# EasyEDA Pro project ProPrj_ESP系列自动烧录平台_2024-12-23.epro, schematic ESP系列自动烧录平台 copy
Board Name: ESP系列自动烧录平台 copy; Create Date: 2024-03-04; Page Name: ESP全系列烧录平台 copy; Project Name: ESP系列自动烧录平台; Schematic Name: ESP系列自动烧录平台 copy; Update Date: 2024-04-26; Drawed: clistery
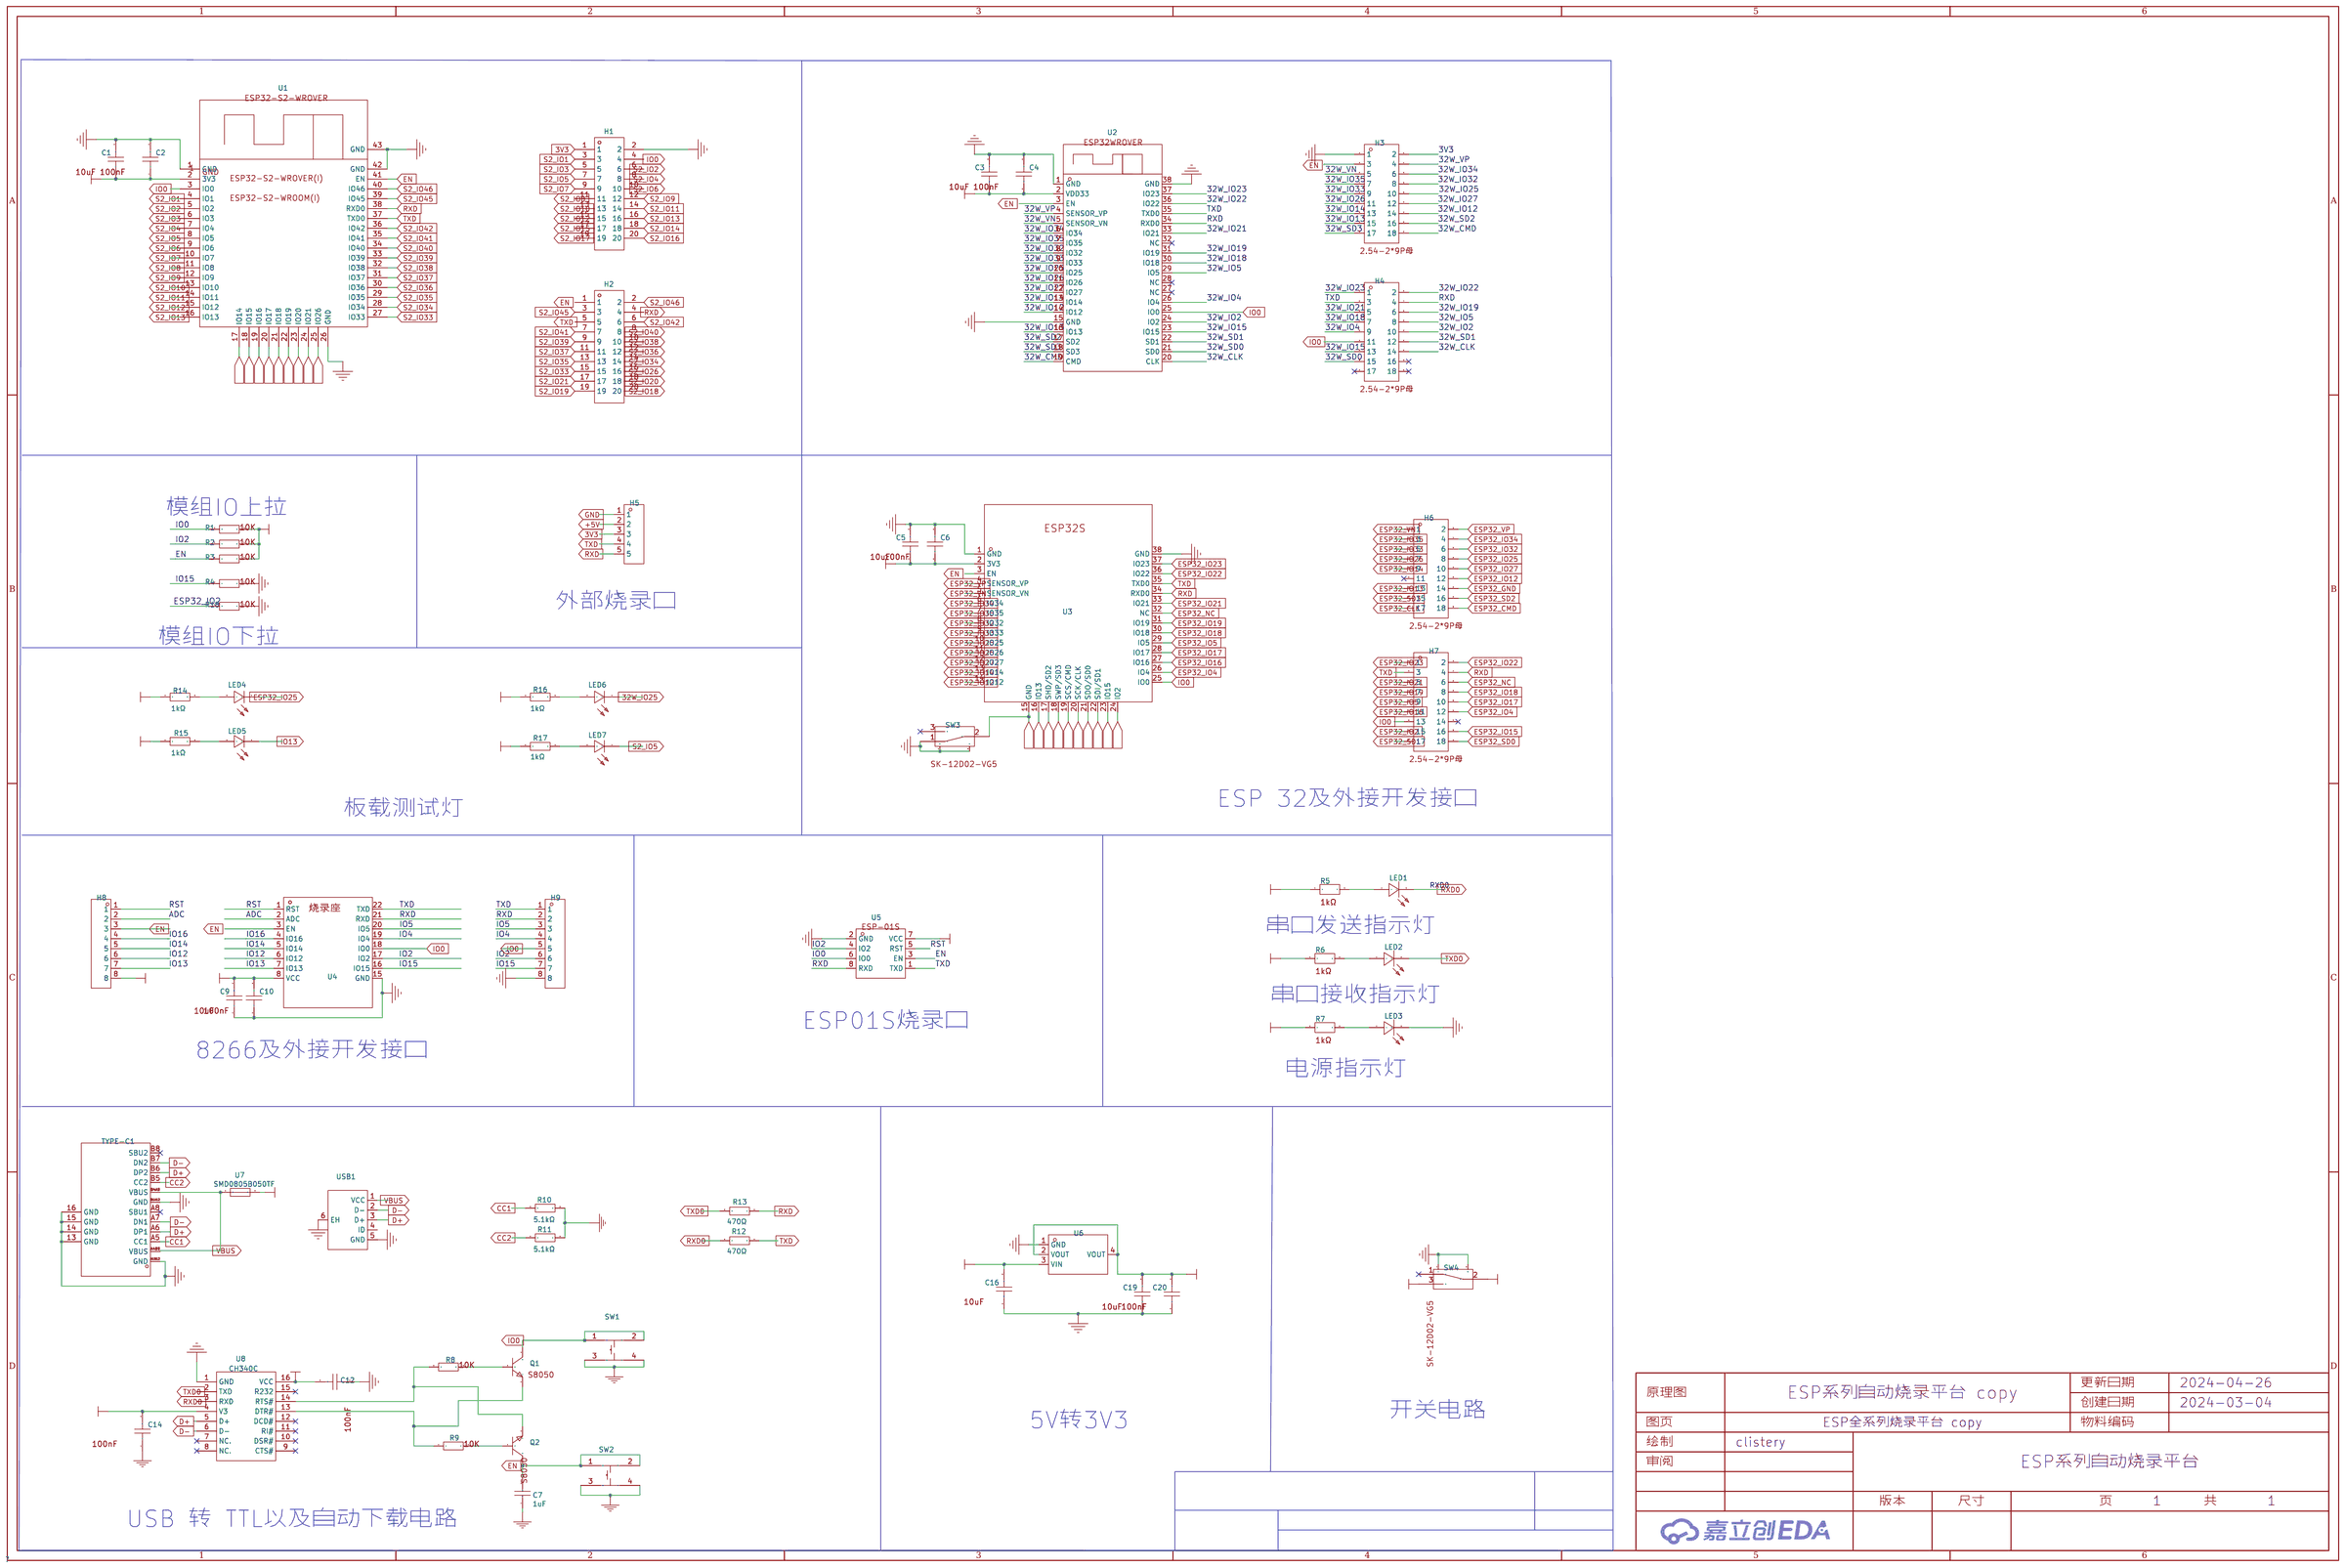
[diagram p0: schematic sheet]

## Parts
C1  10uF  [10uF]
C2  100nF  [100nF]
C3  10uF  [10uF]
C4  100nF  [100nF]
C5  10uF  [10uF]
C6  100nF  [100nF]
C7  1uF  [C0603]
C9  10uF  [10uF]
C10  100nF  [100nF]
C12  100nF  [100nF]
C14  100nF  [100nF]
C16  10uF  [10uF]
C19  10uF  [10uF]
C20  100nF  [100nF]
H1  220S-2*10P H=8.5MM Ytype Gold-plated  [HDR-TH_20P-P2.54-V-F-R2-C10-S2.54]
H2  220S-2*10P H=8.5MM Ytype Gold-plated  [HDR-TH_20P-P2.54-V-F-R2-C10-S2.54]
H3  2.54-2*9P母  [2.54-2*9P母]
H4  2.54-2*9P母  [2.54-2*9P母]
H5  PH-00759  [PH-00759]
H6  2.54-2*9P母  [2.54-2*9P母]
H7  2.54-2*9P母  [2.54-2*9P母]
H8  KH-2.54PH180-1X8P-L11.5  [KH-2.54PH180-1X8P-L11.5]
H9  KH-2.54PH180-1X8P-L11.5  [KH-2.54PH180-1X8P-L11.5]
LED1  NCD0603R3  [NCD0603R3]
LED2  NCD0603R3  [NCD0603R3]
LED3  NCD0603R3  [NCD0603R3]
LED4  FC-DA1608HRK-620D  [LED0603-RD_RED]
LED5  FC-DA1608HRK-620D  [LED0603-RD_RED]
LED6  FC-DA1608HRK-620D  [LED0603-RD_RED]
LED7  FC-DA1608HRK-620D  [LED0603-RD_RED]
Q1  S8050  [S8050]
Q2  S8050  [S8050]
R1  10K  [10K]
R2  10K  [10K]
R3  10K  [10K]
R4  10K  [10K]
R5  1kΩ  [1kΩ]
R6  1kΩ  [1kΩ]
R7  1kΩ  [1kΩ]
R8  10K  [10K]
R9  10K  [10K]
R10  5.1kΩ  [R0603]
R11  5.1kΩ  [R0603]
R12  470Ω  [R0603]
R13  470Ω  [R0603]
R14  1kΩ  [R0603]
R15  1kΩ  [R0603]
R16  1kΩ  [R0603]
R17  1kΩ  [R0603]
R18  10K  [10K]
SW1  TS-1009S-04526  [SW-SMD_4P-L4.5-W4.5-P3.00-LS7.0]
SW2  TS-1009S-04526  [SW-SMD_4P-L4.5-W4.5-P3.00-LS7.0]
SW3  SK-12D02-VG5  [SK-12D02-VG5]
SW4  SK-12D02-VG5  [SK-12D02-VG5]
TYPE-C1  TYPEC-304-BCP16  [TYPEC-304-BCP16]
U1  ESP32-S2-WROVER
U2  ESP32­WROVER
U3  ESP32_烧录座
U4  ESP12F烧录  [ESP12F烧录]
U5  ESP-01S  [ESP-01S]
U6  AMS1117-3.3  [AMS1117-3.3]
U7  SMD0805B050TF  [F0805]
U8  CH340C  [SOP-16_L10.0-W3.9-P1.27-LS6.0-BL]
USB1  MK5P卧贴带柱  [MICRO-USB-SMD_5P-P0.65-H-M_MICRO-USB-5P]

## Library data of the parts
C1 C3 C5 C9 C16 C19 = 10uF: 容值:10uF;精度:±20%;额定电压:-;材质(温度系数):-;; LCSC Part Name: 10uF ±20%; Supplier Part: C669868; Manufacturer: TAIYO YUDEN(太诱); Manufacturer Part: JMK107BC6106MA-T; Supplier Footprint: 0603; JLCPCB Part Class: Extended Part; Datasheet: https://atta.szlcsc.com/upload/public/pdf/source/20200708/C669868_7EB6EA763537011BBD5B3495B56B624F.pdf; Supplier: LCSC; Tolerance: ±20%
C2 C4 C6 C10 C12 C14 C20 = 100nF: Supplier Footprint: 0603
C7 = 1uF: Supplier: LCSC; Manufacturer: SAMSUNG(三星); Supplier Part: C15849; JLCPCB Part Class: Basic Part
H1 H2 = 220S-2*10P H=8.5MM Ytype Gold-plated: Supplier: LCSC; Manufacturer: Ckmtw(灿科盟); Manufacturer Part: B-2200S20P-B120; Supplier Part: C124419; JLCPCB Part Class: Extended Part
H3 H4 H6 H7 = 2.54-2*9P母: 排数:双排;总孔位数:18;间距:2.54mm;行距:-;安装类型:直插;塑高:-;触头材质:-;触头镀层:-;; LCSC Part Name: 2.54mm; Supplier Part: C71956; Manufacturer: BOOMELE(博穆精密); Supplier Footprint: 插件,P=2.54mm; JLCPCB Part Class: Extended Part; Supplier: LCSC; Number of Rows: 双排; Number of Holes: 18; Pitch: 2.54mm; Mounting Type: 直插
H5 = PH-00759: LCSC Part Name: 1x5P 2.54mm; Supplier Part: C2974711; Manufacturer: Liansheng(连盛); Supplier Footprint: 直插,P=2.54mm; JLCPCB Part Class: Extended Part; Datasheet: https://atta.szlcsc.com/upload/public/pdf/source/20220406/F122DCCBD34C8E75E2B509030A88CB3A.pdf; Supplier: LCSC
H8 H9 = KH-2.54PH180-1X8P-L11.5: 排数:单排;总PIN位数:8;间距:2.54mm;插针结构:1x8P;行距:-;安装类型:直插;圆针/方针:方针;额定电流:3A;额定电压:-;配合针长度:6mm;塑高:2.5mm;端接针长度:3mm;触头材质:-;工作温度范围:-40℃+105℃;颜色:黑色;; LCSC Part Name: 2.54mm 1x8P 直插 方针; Supplier Part: C2905487; Manufacturer: kinghelm(金航标); Supplier Footprint: 直插,P=2.54mm; JLCPCB Part Class: Extended Part; Datasheet: https://atta.szlcsc.com/upload/public/pdf/source/20211019/E207DA256892DEA6FC546F48FC628120.pdf; Supplier: LCSC; Number of Rows: 单排; Number of Pins: 8; Pitch: 2.54mm; Pin Structure: 1x8P; Mounting Type: 直插; Circluar Pins/Square Pins: 方针; Current Rating (Max): 3A; Length of Mating Pin: 6mm; Insulation Height: 2.5mm; Length of End Connection Pin: 3mm; Operating Temperature Range: -40℃+105℃; Color: 黑色
LED1-LED3 = NCD0603R3: 红色；贴片LED；0603红灯；透镜颜色：无色透明；发光角度：130°；功率：65mW；工作温度：-30℃+85℃；尺寸1.6x0.8x0.8；IF=20ma：1.62.6v，620640nm,51150mcd 金线，光强高，功耗低，可靠性好，寿命长; LCSC Part Name: 红色;贴片LED;0603红灯;; Supplier Part: C3151730; Manufacturer: 国星光电; Supplier Footprint: 0603; JLCPCB Part Class: Extended Part; Datasheet: https://atta.szlcsc.com/upload/public/pdf/source/20220704/CBFF28C1847A97213A75929E60B7DDE7.pdf; Supplier: LCSC
LED4-LED7 = FC-DA1608HRK-620D: Supplier: LCSC; Manufacturer: 国星光电; Supplier Part: C84263; JLCPCB Part Class: Extended Part
Q1 Q2 = S8050: Supplier Part: C5249674; Manufacturer: ElecSuper(静芯微）; Supplier Footprint: SOT-23; JLCPCB Part Class: Extended Part; Datasheet: https://atta.szlcsc.com/upload/public/pdf/source/20221109/F3F5EDE41344C501BF02B6CC0D78E6D8.pdf; Supplier: LCSC
R1-R4 R8 R9 R18 = 10K: Supplier Footprint: 0603
R5-R7 = 1kΩ: 阻值:1kΩ;精度:±5%;; LCSC Part Name: 1kΩ ±5%; Supplier Part: C3017736; Manufacturer: VO(翔胜); Manufacturer Part: SCR0603J1K; Supplier Footprint: 0603; JLCPCB Part Class: Extended Part; Datasheet: https://atta.szlcsc.com/upload/public/pdf/source/20220513/247AF9639BA21CF93567DC289CCC6A22.pdf; Supplier: LCSC; Tolerance: ±5%
R10 R11 = 5.1kΩ: Supplier: LCSC; Manufacturer Part: 0603WAF5101T5E; Manufacturer: UNI-ROYAL(厚声); Supplier Part: C23186; Resistance: 5.1K; JLCPCB Part Class: Basic Part
R12 R13 = 470Ω: Supplier: LCSC; Manufacturer: UNI-ROYAL(厚声); Manufacturer Part: 0603WAF1000T5E; Supplier Part: C22775; Resistance: 100; JLCPCB Part Class: Basic Part
R14-R17 = 1kΩ: Supplier: LCSC; Manufacturer: YAGEO(国巨); Supplier Part: C22548; JLCPCB Part Class: Extended Part
SW1 SW2 = TS-1009S-04526: Supplier: LCSC; Supplier Part: C455245; Manufacturer: XUNPU(讯普); JLCPCB Part Class: Extended Part
SW3 SW4 = SK-12D02-VG5: 额定电流(DC):-;额定电压(DC):-;额定电流(AC):-;额定电压(AC):-;电路结构:单刀双掷;安装方式:卧插;机械寿命:5000;滑钮形状:矩形柱状;引脚样式:PC引脚;工作温度:-25℃+70℃;开关高度:9.5mm;; Supplier Part: C136722; Manufacturer: 韩国韩荣; Supplier Footprint: 插件; JLCPCB Part Class: Extended Part; Datasheet: https://atta.szlcsc.com/upload/public/pdf/source/20180731/C136723_39114FC09BF2E9DC98823B78B7234B45.pdf; Supplier: LCSC; Circuit: 单刀双掷; Mounting Style: 卧插; Mechanical Life: 5000; Actuator Style: 矩形柱状; Pin Style: PC引脚; Operating Temperature: -25℃+70℃; Switch Height: 9.5mm
TYPE-C1 = TYPEC-304-BCP16: 连接器类型:Type-C;标准:USB 3.1;公母:母座;触点数量:16;端口数量:1;安装方式:卧贴;额定电流 - 电源:3A;工作温度范围:-25℃+85℃;焊接温度(最大值):260℃;; LCSC Part Name: Type-C 母座 卧贴 停产 停产; Supplier Part: C720629; Manufacturer: XUNPU(讯普); Supplier Footprint: SMD; JLCPCB Part Class: Extended Part; Datasheet: https://atta.szlcsc.com/upload/public/pdf/source/20220210/1FE0FEFF7D6A20C111212527D3DED014.pdf; Supplier: LCSC; Connector Type: Type-C; Standard: USB 3.1; Gender: 母座; Number of Contacts: 16; Number of Ports: 1; Mounting Style: 卧贴; Current Rating - Power (Max): 3A; Operating Temperature Range: -25℃+85℃; Welding Temperature (Max): 260℃
U1 = ESP32-S2-WROVER: NUMBER: 1
U2 = ESP32­WROVER: Manufacturer Part: ncfws; Supplier: ncfws; Supplier Part: ncfws
U3 = ESP32_烧录座: Supplier: LCSC; Supplier Part: C82899; Manufacturer: Ai-Thinker; Manufacturer Part: ESP-32S
U4 = ESP12F烧录
U5 = ESP-01S: Supplier Part: C503582; Manufacturer: Ai-Thinker(安信可); Supplier Footprint: Module; JLCPCB Part Class: Extended Part; Datasheet: https://atta.szlcsc.com/upload/public/pdf/source/20200407/C503582_1139AF8FB42E05635FA0089E1752A536.pdf; Supplier: LCSC
U6 = AMS1117-3.3_C917183: 输出类型:-;; Supplier Part: C917183; Manufacturer: JSMSEMI(杰盛微); Supplier Footprint: SOT-223; JLCPCB Part Class: Extended Part; Datasheet: https://atta.szlcsc.com/upload/public/pdf/source/20211201/578FEEF9766904D398893791CE3EC879.pdf; Supplier: LCSC
U7 = SMD0805B050TF: Supplier: LCSC; Supplier Part: C269104; Manufacturer: Brightking(君耀电子); JLCPCB Part Class: Extended Part
U8 = CH340C: Supplier: LCSC; Manufacturer: WCH(南京沁恒); Supplier Part: C84681; JLCPCB Part Class: Extended Part
USB1 = MK5P卧贴带柱: 连接器类型:Micro-B;标准:USB 2.0;公母:母;端口数量:1;触点数量:5P;安装方式:卧贴;额定电流 - 电源:1A;工作温度范围:-30℃~+80℃;; LCSC Part Name: Micro-B 母 卧贴; Supplier Part: C21377; Manufacturer: BOOMELE(博穆精密); Supplier Footprint: SMD; JLCPCB Part Class: Extended Part; Datasheet: https://atta.szlcsc.com/upload/public/pdf/source/20160113/1457707752654.pdf; Supplier: LCSC; Connector Type: Micro-B; Standard: USB 2.0; Gender: 母; Number of Ports: 1; Number of Contacts: 5P; Mounting Style: 卧贴; Current Rating - Power (Max): 1A; Operating Temperature Range: -30℃~+80℃

## Nets
3V3: C1.1 C2.1 C3.1 C4.1 C5.1 C6.1 C9.2 C10.2 C12.2 C14.2 C19.2 C20.2 H1.1 H3.2 H5.3 H8.8 R1.2 R2.2 R3.2 R5.1 R6.1 R7.1 R14.1 R15.1 R16.1 R17.1 U1.2(3V3) U2.2(VDD33) U3.2(3V3) U4.8(VCC) U5.7(VCC) U6.2(VOUT) U6.4(VOUT) U8.4(V3) U8.16(VCC)
+5V: H5.2 SW4.2 U7.2
GND: C1.2 C2.2 C3.2 C4.2 C5.2 C6.2 C7.1 C9.1 C10.1 C12.1 C14.1 C16.1 C19.1 C20.1 H1.2 H3.1 H5.1 H9.8 LED3.2(K) R4.2 R10.2 R11.2 R18.2 SW1.3 SW1.4 SW2.3 SW2.4 SW3.1 SW3.4 SW3.5 SW4.4 SW4.5 TYPE-C1.13(GND) TYPE-C1.14(GND) TYPE-C1.15(GND) TYPE-C1.16(GND) TYPE-C1.A1B12(GND) TYPE-C1.B1A12(GND) U1.1(GND) U1.26(GND) U1.42(GND) U1.43(GND) U2.1(GND) U2.15(GND) U2.38(GND) U3.1(GND) U3.38(GND) U4.15(GND) U5.2(GND) U6.1(GND) U8.1(GND) USB1.5(GND) USB1.6(EH)
VBUS: TYPE-C1.A4B9(VBUS) TYPE-C1.B4A9(VBUS) U7.1 USB1.1(VCC)
VCC: C16.2 SW4.3 U6.3(VIN)
32W_CLK: H4.14 U2.20(CLK)
32W_CMD: H3.18 U2.19(CMD)
32W_IO2: H4.10 U2.24(IO2)
32W_IO4: H4.9 U2.26(IO4)
32W_IO5: H4.8 U2.29(IO5)
32W_IO12: H3.14 U2.14(IO12)
32W_IO13: H3.15 U2.16(IO13)
32W_IO14: H3.13 U2.13(IO14)
32W_IO15: H4.13 U2.23(IO15)
32W_IO18: H4.7 U2.30(IO18)
32W_IO19: H4.6 U2.31(IO19)
32W_IO21: H4.5 U2.33(IO21)
32W_IO22: H4.2 U2.36(IO22)
32W_IO23: H4.1 U2.37(IO23)
32W_IO25: H3.10 LED6.1(K) U2.10(IO25)
32W_IO26: H3.11 U2.11(IO26)
32W_IO27: H3.12 U2.12(IO27)
32W_IO32: H3.8 U2.8(IO32)
32W_IO33: H3.9 U2.9(IO33)
32W_IO34: H3.6 U2.6(IO34)
32W_IO35: H3.7 U2.7(IO35)
32W_SD0: H4.15 U2.21(SD0)
32W_SD1: H4.12 U2.22(SD1)
32W_SD2: H3.16 U2.17(SD2)
32W_SD3: H3.17 U2.18(SD3)
32W_VN: H3.5 U2.5(SENSOR_VN)
32W_VP: H3.4 U2.4(SENSOR_VP)
ADC: H8.2 U4.2(ADC)
CC1: R10.1 TYPE-C1.A5(CC1)
CC2: R11.1 TYPE-C1.B5(CC2)
D+: TYPE-C1.A6(DP1) TYPE-C1.B6(DP2) U8.5(D+) USB1.3(D+)
D-: TYPE-C1.A7(DN1) TYPE-C1.B7(DN2) U8.6(D-) USB1.2(D-)
EN: C7.2 H2.1 H3.3 H8.3 Q2.3(C) R3.1 SW2.1 SW2.2 U1.41(EN) U2.3(EN) U3.3(EN) U4.3(EN) U5.3(EN)
ESP32_CLK: H6.17 U3.20(SCK/CLK)
ESP32_CMD: H6.18 U3.19(SCS/CMD)
ESP32_GND: H6.14 SW3.2 U3.15(GND)
ESP32_IO2: H7.15 R18.1 U3.24(IO2)
ESP32_IO4: H7.12 U3.26(IO4)
ESP32_IO5: H7.9 U3.29(IO5)
ESP32_IO12: H6.12 U3.14(IO12)
ESP32_IO13: H6.13 U3.16(IO13)
ESP32_IO14: H6.9 U3.13(IO14)
ESP32_IO15: H7.16 U3.23(IO15)
ESP32_IO16: H7.11 U3.27(IO16)
ESP32_IO17: H7.10 U3.28(IO17)
ESP32_IO18: H7.8 U3.30(IO18)
ESP32_IO19: H7.7 U3.31(IO19)
ESP32_IO21: H7.5 U3.33(IO21)
ESP32_IO22: H7.2 U3.36(IO22)
ESP32_IO23: H7.1 U3.37(IO23)
ESP32_IO25: H6.8 LED4.1(K) U3.10(IO25)
ESP32_IO26: H6.7 U3.11(IO26)
ESP32_IO27: H6.10 U3.12(IO27)
ESP32_IO32: H6.6 U3.8(IO32)
ESP32_IO33: H6.5 U3.9(IO33)
ESP32_IO34: H6.4 U3.6(IO34)
ESP32_IO35: H6.3 U3.7(IO35)
ESP32_NC: H7.6 U3.32(NC)
ESP32_SD0: H7.18 U3.21(SDO/SD0)
ESP32_SD1: H7.17 U3.22(SDI/SD1)
ESP32_SD2: H6.16 U3.17(SHD/SD2)
ESP32_SD3: H6.15 U3.18(SWP/SD3)
ESP32_VN: H6.1 U3.5(SENSOR_VN)
ESP32_VP: H6.2 U3.4(SENSOR_VP)
IO0: H1.4 H4.11 H7.13 H9.5 Q1.3(C) R1.1 SW1.1 SW1.2 U1.3(IO0) U2.25(IO0) U3.25(IO0) U4.18(IO0) U5.6(IO0)
IO2: H9.6 R2.1 U4.17(IO2) U5.4(IO2)
IO4: H9.4 U4.19(IO4)
IO5: H9.3 U4.20(IO5)
IO12: H8.6 U4.6(IO12)
IO13: H8.7 LED5.1(K) U4.7(IO13)
IO14: H8.5 U4.5(IO14)
IO15: H9.7 R4.1 U4.16(IO15)
IO16: H8.4 U4.4(IO16)
RST: H8.1 U4.1(RST) U5.5(RST)
RXD: H2.4 H4.4 H5.5 H7.4 H9.2 R13.1 U1.38(RXD0) U2.34(RXD0) U3.34(RXD0) U4.21(RXD) U5.8(RXD)
RXD0: LED1.2(K) R12.2 U8.3(RXD)
S2_IO1: H1.3 U1.4(IO1)
S2_IO2: H1.6 U1.5(IO2)
S2_IO3: H1.5 U1.6(IO3)
S2_IO4: H1.8 U1.7(IO4)
S2_IO5: H1.7 LED7.1(K) U1.8(IO5)
S2_IO6: H1.10 U1.9(IO6)
S2_IO7: H1.9 U1.10(IO7)
S2_IO8: H1.11 U1.11(IO8)
S2_IO9: H1.12 U1.12(IO9)
S2_IO10: H1.13 U1.13(IO10)
S2_IO11: H1.14 U1.14(IO11)
S2_IO12: H1.15 U1.15(IO12)
S2_IO13: H1.16 U1.16(IO13)
S2_IO14: H1.18 U1.17(IO14)
S2_IO15: H1.17 U1.18(IO15)
S2_IO16: H1.20 U1.19(IO16)
S2_IO17: H1.19 U1.20(IO17)
S2_IO18: H2.20 U1.21(IO18)
S2_IO19: H2.19 U1.22(IO19)
S2_IO20: H2.18 U1.23(IO20)
S2_IO21: H2.17 U1.24(IO21)
S2_IO26: H2.16 U1.25(IO26)
S2_IO33: H2.15 U1.27(IO33)
S2_IO34: H2.14 U1.28(IO34)
S2_IO35: H2.13 U1.29(IO35)
S2_IO36: H2.12 U1.30(IO36)
S2_IO37: H2.11 U1.31(IO37)
S2_IO38: H2.10 U1.32(IO38)
S2_IO39: H2.9 U1.33(IO39)
S2_IO40: H2.8 U1.34(IO40)
S2_IO41: H2.7 U1.35(IO41)
S2_IO42: H2.6 U1.36(IO42)
S2_IO45: H2.3 U1.39(IO45)
S2_IO46: H2.2 U1.40(IO46)
TXD: H2.5 H4.3 H5.4 H7.3 H9.1 R12.1 U1.37(TXD0) U2.35(TXD0) U3.35(TXD0) U4.22(TXD) U5.1(TXD)
TXD0: LED2.2(K) R13.2 U8.2(TXD)
Net-(LED1-1): LED1.1(A) R5.2
Net-(LED2-1): LED2.1(A) R6.2
Net-(LED3-1): LED3.1(A) R7.2
Net-(LED4-2): LED4.2(A) R14.2
Net-(LED5-2): LED5.2(A) R15.2
Net-(LED6-2): LED6.2(A) R16.2
Net-(LED7-2): LED7.2(A) R17.2
Net-(Q1-1): Q1.1(B) R8.2
Net-(Q1-2): Q1.2(E) R9.1 U8.13(DTR#)
Net-(Q2-1): Q2.1(B) R9.2
Net-(Q2-2): Q2.2(E) R8.1 U8.14(RTS#)

Not connected (* = marked no-connect by the designer): H4 16* 17* 18*; H6 11*; H7 14*; SW3 3*; SW4 1*; TYPE-C1 A8(SBU1)* B8(SBU2)*; U2 27(NC)* 28(NC)* 32(NC)*; U8 7(NC.)* 8(NC.)* 9(CTS#)* 10(DSR#)* 11(RI#)* 12(DCD#)* 15(R232)*; USB1 4(ID)

## Notes on the sheet
- 模组IO上拉
- 外部烧录口
- 模组IO下拉
- ESP 32及外接开发接口
- 板载测试灯
- 串口发送指示灯
- 串口接收指示灯
- ESP01S烧录口
- 8266及外接开发接口
- 电源指示灯
- 开关电路
- 5V转3V3
- USB 转 TTL以及自动下载电路
